# Altium project Antenna_base.PrjPcb
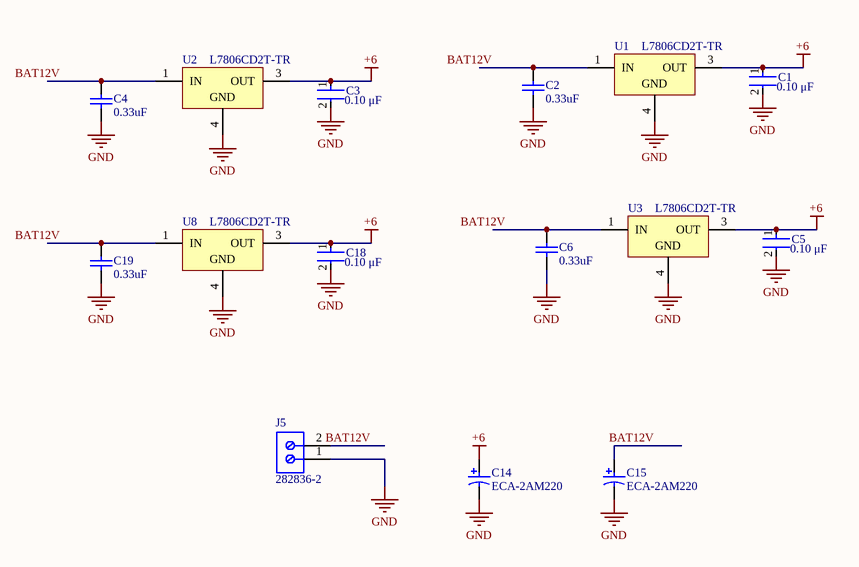
[diagram p0: 01_powersupply.SchDoc]
8 sheets, 143 parts. Net scope: global (net labels, ports and power ports of the same name join across sheets).
Board file: Antenna_base_v5.PcbDoc
Sheets:
  01_powersupply.SchDoc
  02_USB2UART.SchDoc
  05_PWMdriver.SchDoc
  08_CoreBoard.SchDoc
  10_IMU_BREAKOUT.SchDoc
  11_GPS_BREAKOUT.SchDoc
  12_OLED_SCREEN.SchDoc
  13_LED_Array.SchDoc

## Sheet 01_powersupply.SchDoc
size A

### Parts
C1  Capacitance: 0.10 μF  [FP-C0603C-CF-MFG]  (hidden comment: C0603_0.1UF)
C2  value 0.33uF  [CAPC1608X90X20LL10]  (hidden comment: C0603_0.33UF)
C3  Capacitance: 0.10 μF  [FP-C0603C-CF-MFG]  (hidden comment: C0603_0.1UF)
C4  value 0.33uF  [CAPC1608X90X20LL10]  (hidden comment: C0603_0.33UF)
C5  Capacitance: 0.10 μF  [FP-C0603C-CF-MFG]  (hidden comment: C0603_0.1UF)
C6  value 0.33uF  [CAPC1608X90X20LL10]  (hidden comment: C0603_0.33UF)
C14  ECA-2AM220  [CAPPR55-250-1120X630X1220]
C15  ECA-2AM220  [CAPPR55-250-1120X630X1220]
C18  Capacitance: 0.10 μF  [FP-C0603C-CF-MFG]  (hidden comment: C0603_0.1UF)
C19  value 0.33uF  [CAPC1608X90X20LL10]  (hidden comment: C0603_0.33UF)
J5  282836-2  [TECO-282836-2_V]
U1  L7806CD2T-TR  [TO-263_L]
U2  L7806CD2T-TR  [TO-263_L]
U3  L7806CD2T-TR  [TO-263_L]
U8  L7806CD2T-TR  [TO-263_L]

### Nets
+6: C1.1 C3.1 C5.1 C14.1 C18.1 U1.3(OUT) U2.3(OUT) U3.3(OUT) U8.3(OUT)  [project net PWM_VDD]
GND: C1.2 C2.1 C3.2 C4.1 C5.2 C6.1 C14.2 C15.2 C18.2 C19.1 J5.1 U1.4(GND) U2.4(GND) U3.4(GND) U8.4(GND)
BAT12V: C2.2 C4.2 C6.2 C15.1 C19.2 J5.2 U1.1(IN) U2.1(IN) U3.1(IN) U8.1(IN)

### Library data of the parts
C1 C3 C5 C18 = CMP-03020-016578-1: CAP CER 0.1UF 16V X7R 0603; Manufacturer Part Number: C0603C104M4RAC7411; Manufacturer: KEMET; Tolerance: 0.2; Value: 0.10 μF; Automotive Grade: Grade 1; Material: Ceramic; Temperature Coefficient: 30ppm/°C; RoHS: TRUE; Temperature: -55°C to +125°C; Automotive: Yes; Device Class L3: Ceramic Capacitors; Temperature Characteristic: X7R; Package: C0603C-CF; Digikey Description: CAP CER 0.1UF 16V X7R 0603; ComponentLink2URL: https://api.kemet.com/component-edge/download/datasheet/C0603C100J5GACAUTO.pdf; Mouser Description: Multilayer Ceramic Capacitors MLCC - SMD/SMT 16volts 0.1uF X7R 20%; Voltage Rating: 16 V; Temperature Range High: +125°C; Temperature Range Low: -55°C; Height: 0.87mm; Device Class L1: Passive Components; ComponentLink2Description: Datasheet; Lead Free: Yes; Category: Cap; Device Class L2: Capacitors; Octopart: https://octopart.com/c0603c104m4rac7411-kemet-9138805
C2 C4 C6 C19 = CMP-2000-07551-1: Chip Capacitor, 0.33 uF, +/- 10%, 50 V, -55 to 125 degC, 0603 (1608 Metric), RoHS, Tape and Reel; Manufacturer: TDK; Datasheet URL: https://product.tdk.com/info/en/catalog/datasheets/mlcc_commercial_general_en.pdf; Manufacturer URL: http://www.tdk.com/; Package Description: 2-Pin Surface Mount Device, Body 1.6 x 0.8 mm; Mounting Technology: SurfaceMount; Datasheet Version: 07/2017; Package Reference: 603
C14 C15 = CMP-1665-00035-2: Aluminum Electrolytic Capacitor, 22 uF, +/- 20%, 100 V, -40 to 85 degC, 2-Pin THD, RoHS, Bulk; Nominal Vf: 2.1 V; Luminous Intensity: 2 mcd; Viewing Angle: 130 degrees; Lens Style: Clear; Colour: Orange; Forward Current: 20 mA; Case\Package: 0603; ComponentLink2URL: https://industrial.panasonic.com/cdbs/www-data/pdf/RDF0000/ABA0000C1047.pdf; Height: 1.1 mm; Max Operating Temperature: 85 degC; Width: 0.8 mm; ComponentLink1Description: Manufacturer URL; Min Operating Temperature: -55 degC; Package Quantity: 3000; RoHSCompliant: true; DatasheetVersion: Mar-16; Length: 1.6 mm; ComponentLink1URL: http://www.panasonic.com/; Packaging: Tape and Reel; Case Code (Imperial): 0603; Radiation Hardening: No; ComponentLink2Description: Datasheet; Mount: Surface Mount; PackageDescription: 2-Pin Through Hole Device, Dia 6.3 mm, Body Length 11.2 mm; Pins: 2; PackageReference: Radial; Illumination Colour: Orange; Case Code (Metric): 1608; Forward Voltage: 2.1 V
J5 = CMP-1684-00017-1: Female Header, Pitch 5 mm, 1 x 2 Position, Height 10 mm, Tail Length 3.5 mm, Rohs, Bulk; Manufacturer: TE Connectivity; Wire Gauge: 16-30AWG; Product Training Modules: Wire-to-BoardEurostyleTerminalBlocks; Clamp Material - Plating: Brass-NickelPlated; Voltage: 300V; Mating Orientation: HorizontalwithBoard; Current: 13.5A; Pitch: 0.197"(5.00mm); Screw Thread: M3; 3D Model: 282836-2.pdf; Other Names: 5ULV-02B / A98076; Dynamic Catalog: BuchananSeries; Number of Levels: 1; Torque - Screw: 0.68Nm(6Lb-In); Featured Product: EurostyleTerminalBlockConnectors; Positions Per Level: 2; Wire Termination: Screw-RisingCageClamp; Datasheet URL: http://www.te.com.cn/commerce/DocumentDelivery/DDEController?Action=showdoc&DocId=Catalog+Section%7F1308389_EUROSTYLE_TERMINAL_BLOCKS%7F0607%7Fpdf%7FEnglish%7FENG_CS_1308389_EUROSTYLE_TERMINAL_BLOCKS_0607.pdf%7F282836-2; Color: Green; Family: TerminalBlocks-WiretoBoard; RoHS Information: 282836-2StatementofCompliance; Standard Package: 300; Contact Material - Plating: Brass-TinPlated; Manufacturer URL: http://www.te.com; Housing Material: Polyamide(PA66),Nylon6/6; Features: Interlocking(Side); Package Description: Female Header, Pitch 5 mm, 1 x 2 Position, Height 10 mm, Tail Length 3.5 mm; Mounting Type: ThroughHole; Package Reference: THD; Packaging: Bulk; Series: Buchanan; Category: Connectors,Interconnects; Screw Material - Plating: Brass-NickelPlated
U1-U3 U8 = CMP-0244-00208-1: Positive Voltage Regulator, 3-Pin D2PAK, Tape and Reel; PackageDescription: 3-Pin Transistor Outline Package 2.54 mm Pitch, 15.4 mm Lead Span (D2PAK); ComponentLink1Description: Manufacturer URL; ComponentLink2URL: http://www.st.com/internet/com/TECHNICAL_RESOURCES/TECHNICAL_LITERATURE/DATASHEET/CD00000444.pdf; ComponentLink1URL: http://www.st.com; ComponentLink2Description: Datasheet; DatasheetVersion: 16/11/2011; PackageReference: TO-263; PackageVersion: 2011

## Sheet 02_USB2UART.SchDoc
size Letter
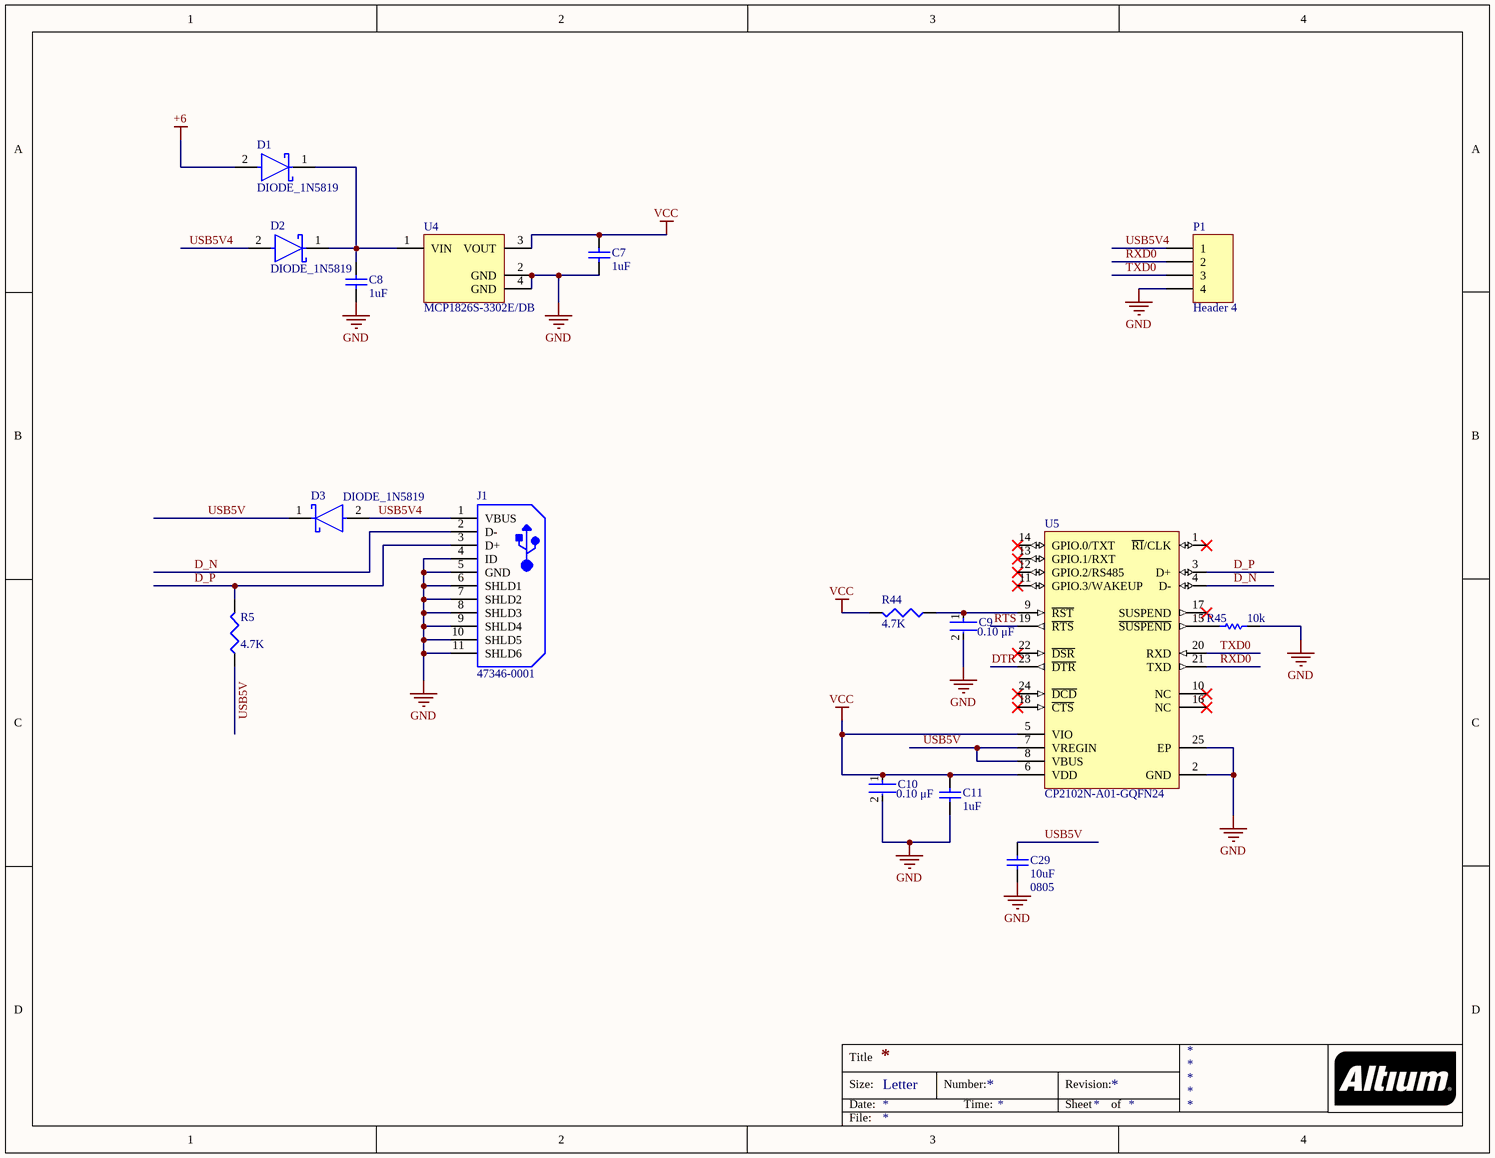
[diagram p1: 02_USB2UART.SchDoc]

### Parts
C7  value 1uF  [CAPC1608X87X35LL15T15]  (hidden comment: C0603_1UF)
C8  value 1uF  [CAPC1608X87X35LL15T15]  (hidden comment: C0603_1UF)
C9  Capacitance: 0.10 μF  [FP-C0603C-CF-MFG]  (hidden comment: C0603_0.1UF)
C10  Capacitance: 0.10 μF  [FP-C0603C-CF-MFG]  (hidden comment: C0603_0.1UF)
C11  value 1uF  [CAPC1608X87X35LL15T15]  (hidden comment: C0603_1UF)
C29  value 10uF  Package: 0805  [CAPC2013X135X50LL10T20]  (hidden comment: C0805_10UF)
D1  DIODE_1N5819  [FP-SOD123-MFG]
D2  DIODE_1N5819  [FP-SOD123-MFG]
D3  DIODE_1N5819  [FP-SOD123-MFG]
J1  47346-0001  [MOLX-47346-0001-5_V]
P1  Header 4  [HDR1X4]
R5  value 4.7K  [J1-0603]  (hidden comment: R0603_4.7K)
R44  value 4.7K  [J1-0603]  (hidden comment: R0603_4.7K)
R45  value 10k  [RESC1609X55X30LL15T15]  (hidden comment: R0603_10K)
U4  MCP1826S-3302E/DB  [SOT-223-DB3_L]
U5  CP2102N-A01-GQFN24  [SLAB-QFN-24-2550x2550TP_A_V]

### Nets
+6: D1.2(A)  [project net PWM_VDD]
GND: C7.1 C8.1 C9.2 C10.2 C11.1 C29.1 J1.4(ID) J1.5(GND) J1.6(SHLD1) J1.7(SHLD2) J1.8(SHLD3) J1.9(SHLD4) J1.10(SHLD5) J1.11(SHLD6) P1.4 R45.2 U4.2(GND) U4.4(GND) U5.2(GND) U5.25(EP)
VCC: C7.2 C10.1 C11.2 R44.2 U4.3(VOUT) U5.5(VIO) U5.6(VDD)
D_N: J1.2(D-) U5.4(D-)
D_P: J1.3(D+) R5.2 U5.3(D+)
DTR: U5.23(~{DTR})
RTS: U5.19(~{RTS})
RXD0: P1.2 U5.21(TXD)
TXD0: P1.3 U5.20(RXD)
USB5V: C29.2 D3.1(C) R5.1 U5.7(VREGIN) U5.8(VBUS)
USB5V4: D2.2(A) D3.2(A) J1.1(VBUS) P1.1
NetC8_2: C8.2 D1.1(C) D2.1(C) U4.1(VIN)
NetC9_1: C9.1 R44.1 U5.9(~{RST})
NetR45_1: R45.1 U5.15(~{SUSPEND})

Not connected (* = marked no-connect by the designer): U5 1(~{RI}/CLK)* 10(NC)* 11(GPIO.3/WAKEUP)* 12(GPIO.2/RS485)* 13(GPIO.1/RXT)* 14(GPIO.0/TXT)* 16(NC)* 17(SUSPEND)* 18(~{CTS})* 22(~{DSR})* 24(~{DCD})*

### Notes on the sheet
- Title
- Size:
- Date:
- Letter
- Number:
- Time:
- Revision:
- Sheet
- of
- File:

### Library data of the parts
C7 C8 C11 = CMP-2006-03318-1: Manufacturer: Kemet; Part Number: C0603C101J1GACTU
C9 C10 = CMP-03020-016578-1: as C1 on sheet 01_powersupply; RoHS: TRUE; Temperature: -55°C to +125°C; Automotive: Yes; Device Class L3: Ceramic Capacitors; Temperature Characteristic: X7R; Package: C0603C-CF; Digikey Description: CAP CER 0.1UF 16V X7R 0603; ComponentLink2URL: https://api.kemet.com/component-edge/download/datasheet/C0603C100J5GACAUTO.pdf; Mouser Description: Multilayer Ceramic Capacitors MLCC - SMD/SMT 16volts 0.1uF X7R 20%; Voltage Rating: 16 V; Temperature Range High: +125°C; Temperature Range Low: -55°C; Height: 0.87mm; Device Class L1: Passive Components; ComponentLink2Description: Datasheet; Lead Free: Yes; Category: Cap; Device Class L2: Capacitors; Octopart: https://octopart.com/c0603c104m4rac7411-kemet-9138805
C29 = CMP-2007-03453-1: Manufacturer: Murata; Part Number: GRM21BR61C106KE15L
D1-D3 = CMP-12790-000018-1: DIODE SCHOTTKY 40V 1A SOD123; Manufacturer: Diodes Inc; Manufacturer Part Number: 1N5819HW-7-F; Max Surge Forward Current: 25A; Peak Reverse Current: 1mA; Max Junction Temp: +125°C; Import Ts: 1521843113; Vr V: 40; Standoff Height: 0mm; Capacitance: 50pF; Value: 50pF; Ciiva Ids: 815630; If A: 1; Automotive: No; Device Class L1: Discrete Semiconductors; Octopart: https://octopart.com/1n5819hw-7-f-diodes+inc.-323197; Terminal Temperature Tt Degc: 90; ComponentLink2Description: Datasheet; Temperature Range High: +125°C; Package: SOD123; Reverse Voltage: 40V; Temperature Range Low: -65°C; Mouser Description: 1N5819HW Series 40 V 1 A Surface Mount Schottky Barrier Rectifier - SOD-123; Device Class L2: Diodes; Lead Free: Yes; Max Repetitive Reverse Voltage: 40V; Ipc Land Pattern Name: SOD365155X123-2; Forward Current: 1A; Device Class L3: Schottky Diodes; Digikey Description: DIODE SCHOTTKY 40V 1A SOD123; ComponentLink2URL: https://www.diodes.com/assets/Datasheets/ds30217.pdf; Footprint Url: https://www.diodes.com/assets/Package-Files/SOD123.pdf; RoHS: TRUE; Category: Diode; Height: 1.45mm; Release Date: 1385348939; Temperature: -65°C to +125°C
J1 = CMP-2000-05246-1: Micro-USB B Receptacle with Flange, -30 to 85 degC, 5-Pin SMD, RoHS, Tape and Reel; Manufacturer: Molex; Number of Contacts: 5; Body Orientation: RightAngle; Maximum Voltage Rating: 30VAC; Pitch: 0.65mm; Maximum Current Rating: 1.8/ContactA; Number of Ports: 1; Gender: RCP; Operating Temperature: -30to85C; Part No: 47346-0001; Color: Black; Termination Method: Solder; Contact Plating: GoldOverPalladiumNickelOverNickel; Dimension: 7.8x5.43x2.94mm; Number of Terminals: 5; Datasheet Version: Dec-13; Datasheet URL: https://datasheet.ciiva.com/30075/304740473460001-io-nectors-30075527.pdf; Contact Material: CopperAlloy; RoHS: Yes; Housing Material: LiquidCrystalPolymer; Manufacturer URL: http://www.molex.com/; Packaging: EmbossedTapeandReel; Mounting: SurfaceMount; Type: MicroUSBTypeB
P1 = Header 4: Header, 4-Pin; LatestRevisionDate: 17-Jul-2002; LatestRevisionNote: Re-released for DXP Platform.; Publisher: Altium Limited
R5 R44 = Res3: Resistor; Published: 8-Jun-2000; LatestRevisionDate: 29-May-2009; LatestRevisionNote: IPC-7351 Footprint Added.; PackageReference: J1-0603; Publisher: Altium Limited; PackageDescription: Chip Resistor
R45 = CMP-2000-07452-1: Chip Resistor, 10 KOhm, +/- 1%, 0.1 W, -55 to 155 degC, 0603 (1608 Metric), RoHS, Tape and Reel; Manufacturer: Panasonic; Voltage Rating: 75V; Case\/Package: 0603; Power Rating: 100mW; Resistance: 10KOhm; Temperature Coefficient: 100ppm\/degreesC; Number of Pins: 2; Package Reference: 603; Depth: 0.8mm; Mount: SurfaceMount; Package Description: 2-Pin Surface Mount Device, Body 1.6 x 0.85 mm; Datasheet Version: 02/2017; Length: 1.6mm; Lead Free: LeadFree; Height: 0.45mm; Number of Terminations: 2; Max Power Dissipation: 100mW; Min Operating Temperature: -55degC; Datasheet URL: https://industrial.panasonic.com/cdbs/www-data/pdf/RDA0000/AOA0000C304.pdf; Termination: SMD/SMT; Case Code (Metric): 1608; Case Code (Imperial): 0603; Tolerance: 1%; Max Operating Temperature: 155degC; RoHSCompliant: true; Voltage Rating (DC): 75V; Radiation Hardening: No; Packaging: TapeandReel; Composition: ThickFilm; Mounting Technology: SurfaceMount; Manufacturer URL: http://www.panasonic.com/; Width: 0.031inch; REACH SVHC: NoSVHC; Contact Plating: Tin; Military Standard: Not; Package Quantity: 1
U4 = CMP-0136-00504-1: 1000 mA, Low Voltage, Low Quiescent Current LDO Regulator, 3-Pin SOT-223, Extended Temperature; PackageVersion: revBB, Aug-2009; PackageReference: SOT-223-DB3; DatasheetVersion: revA, Aug-2007; PackageDescription: 3-Lead Plastic Small Outline Transistor (DB) [SOT-223]
U5 = CMP-2000-07570-1: USBXpress(TM) Family, 4 GPIOs, 2.2 to 3.6 V, -40 to 85 degC, 24-Pin QFN, RoHS; Manufacturer: Silicon Labs; Max Supply Voltage: 3.6V; Min Supply Voltage: 3V; Datasheet Version: Rev. 1.1, 08/2016; Max Operating Temperature: 85degC; Case\/Package: QFN; Number of Pins: 24; Min Operating Temperature: -40degC; Mounting Technology: SurfaceMount; Manufacturer URL: http://www.silabs.com/; RoHSCompliant: False; Package Reference: QFN-24-2550x2550TP_A; Datasheet URL: http://www.silabs.com/documents/public/data-sheets/cp2102n-datasheet.pdf; Package Description: 24-Pin Quad Flat No-lead Package, Body 4 x 4 mm, Pitch 0.5 mm; REACH SVHC: Unknown

## Sheet 05_PWMdriver.SchDoc
size A
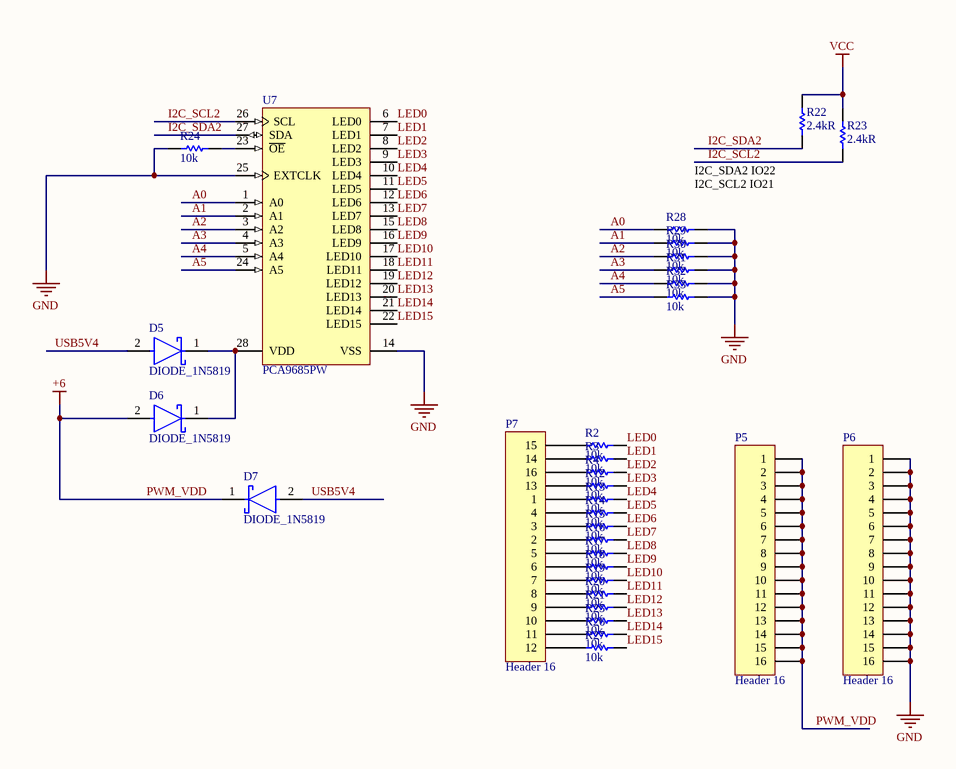
[diagram p2: 05_PWMdriver.SchDoc]

### Parts
D5  DIODE_1N5819  [FP-SOD123-MFG]
D6  DIODE_1N5819  [FP-SOD123-MFG]
D7  DIODE_1N5819  [FP-SOD123-MFG]
P5  Header 16  [HDR1X16]
P6  Header 16  [HDR1X16]
P7  Header 16  [HDR1X16]
R2  value 10k  [RESC1609X55X30LL15T15]  (hidden comment: R0603_10K)
R3  value 10k  [RESC1609X55X30LL15T15]  (hidden comment: R0603_10K)
R4  value 10k  [RESC1609X55X30LL15T15]  (hidden comment: R0603_10K)
R12  value 10k  [RESC1609X55X30LL15T15]  (hidden comment: R0603_10K)
R13  value 10k  [RESC1609X55X30LL15T15]  (hidden comment: R0603_10K)
R14  value 10k  [RESC1609X55X30LL15T15]  (hidden comment: R0603_10K)
R15  value 10k  [RESC1609X55X30LL15T15]  (hidden comment: R0603_10K)
R16  value 10k  [RESC1609X55X30LL15T15]  (hidden comment: R0603_10K)
R17  value 10k  [RESC1609X55X30LL15T15]  (hidden comment: R0603_10K)
R18  value 10k  [RESC1609X55X30LL15T15]  (hidden comment: R0603_10K)
R19  value 10k  [RESC1609X55X30LL15T15]  (hidden comment: R0603_10K)
R20  value 10k  [RESC1609X55X30LL15T15]  (hidden comment: R0603_10K)
R21  value 10k  [RESC1609X55X30LL15T15]  (hidden comment: R0603_10K)
R22  value 2.4kR  [RESC1608X50X30ML20T20]  (hidden comment: R0603_2.4K)
R23  value 2.4kR  [RESC1608X50X30ML20T20]  (hidden comment: R0603_2.4K)
R24  value 10k  [RESC1609X55X30LL15T15]  (hidden comment: R0603_10K)
R25  value 10k  [RESC1609X55X30LL15T15]  (hidden comment: R0603_10K)
R26  value 10k  [RESC1609X55X30LL15T15]  (hidden comment: R0603_10K)
R27  value 10k  [RESC1609X55X30LL15T15]  (hidden comment: R0603_10K)
R28  value 10k  [RESC1609X55X30LL15T15]  (hidden comment: R0603_10K)
R29  value 10k  [RESC1609X55X30LL15T15]  (hidden comment: R0603_10K)
R30  value 10k  [RESC1609X55X30LL15T15]  (hidden comment: R0603_10K)
R31  value 10k  [RESC1609X55X30LL15T15]  (hidden comment: R0603_10K)
R32  value 10k  [RESC1609X55X30LL15T15]  (hidden comment: R0603_10K)
R33  value 10k  [RESC1609X55X30LL15T15]  (hidden comment: R0603_10K)
U7  PCA9685PW  [SOT361-1_V]

### Nets
GND: P6.1 P6.2 P6.3 P6.4 P6.5 P6.6 P6.7 P6.8 P6.9 P6.10 P6.11 P6.12 P6.13 P6.14 P6.15 P6.16 R24.2 R28.1 R29.1 R30.1 R31.1 R32.1 R33.1 U7.14(VSS) U7.25(EXTCLK)
PWM_VDD: D6.2(A) D7.1(C) P5.1 P5.2 P5.3 P5.4 P5.5 P5.6 P5.7 P5.8 P5.9 P5.10 P5.11 P5.12 P5.13 P5.14 P5.15 P5.16  [also labelled +6]
VCC: R22.2 R23.2
A0: R28.2 U7.1(A0)
A1: R29.2 U7.2(A1)
A2: R30.2 U7.3(A2)
A3: R31.2 U7.4(A3)
A4: R32.2 U7.5(A4)
A5: R33.2 U7.24(A5)
I2C_SCL2: R23.1 U7.26(SCL)
I2C_SDA2: R22.1 U7.27(SDA)
LED0: R2.1 U7.6(LED0)
LED1: R3.1 U7.7(LED1)
LED2: R4.1 U7.8(LED2)
LED3: R12.1 U7.9(LED3)
LED4: R13.1 U7.10(LED4)
LED5: R14.1 U7.11(LED5)
LED6: R15.1 U7.12(LED6)
LED7: R16.1 U7.13(LED7)
LED8: R17.1 U7.15(LED8)
LED9: R18.1 U7.16(LED9)
LED10: R19.1 U7.17(LED10)
LED11: R20.1 U7.18(LED11)
LED12: R21.1 U7.19(LED12)
LED13: R25.1 U7.20(LED13)
LED14: R26.1 U7.21(LED14)
LED15: R27.1 U7.22(LED15)
USB5V4: D5.2(A) D7.2(A)
NetD5_1: D5.1(C) D6.1(C) U7.28(VDD)
NetP7_1: P7.1 R13.2
NetP7_2: P7.2 R16.2
NetP7_3: P7.3 R15.2
NetP7_4: P7.4 R14.2
NetP7_5: P7.5 R17.2
NetP7_6: P7.6 R18.2
NetP7_7: P7.7 R19.2
NetP7_8: P7.8 R20.2
NetP7_9: P7.9 R21.2
NetP7_10: P7.10 R25.2
NetP7_11: P7.11 R26.2
NetP7_12: P7.12 R27.2
NetP7_13: P7.13 R12.2
NetP7_14: P7.14 R3.2
NetP7_15: P7.15 R2.2
NetP7_16: P7.16 R4.2
NetR24_1: R24.1 U7.23(~{OE})

### Notes on the sheet
- I2C_SDA2 IO22
  I2C_SCL2 IO21

### Library data of the parts
D5-D7 = CMP-12790-000018-1: as D1 on sheet 02_USB2UART; Automotive: No; Device Class L1: Discrete Semiconductors; Octopart: https://octopart.com/1n5819hw-7-f-diodes+inc.-323197; Terminal Temperature Tt Degc: 90; ComponentLink2Description: Datasheet; Temperature Range High: +125°C; Package: SOD123; Reverse Voltage: 40V; Temperature Range Low: -65°C; Mouser Description: 1N5819HW Series 40 V 1 A Surface Mount Schottky Barrier Rectifier - SOD-123; Device Class L2: Diodes; Lead Free: Yes; Max Repetitive Reverse Voltage: 40V; Ipc Land Pattern Name: SOD365155X123-2; Forward Current: 1A; Device Class L3: Schottky Diodes; Digikey Description: DIODE SCHOTTKY 40V 1A SOD123; ComponentLink2URL: https://www.diodes.com/assets/Datasheets/ds30217.pdf; Footprint Url: https://www.diodes.com/assets/Package-Files/SOD123.pdf; RoHS: TRUE; Category: Diode; Height: 1.45mm; Release Date: 1385348939; Temperature: -65°C to +125°C
P5-P7 = Header 16: Header, 16-Pin; LatestRevisionDate: 17-Jul-2002; LatestRevisionNote: Re-released for DXP Platform.; Publisher: Altium Limited
R2-R4 R12-R21 R24-R33 = CMP-2000-07452-1: as R45 on sheet 02_USB2UART; Number of Pins: 2; Package Reference: 603; Depth: 0.8mm; Mount: SurfaceMount; Package Description: 2-Pin Surface Mount Device, Body 1.6 x 0.85 mm; Datasheet Version: 02/2017; Length: 1.6mm; Lead Free: LeadFree; Height: 0.45mm; Number of Terminations: 2; Max Power Dissipation: 100mW; Min Operating Temperature: -55degC; Datasheet URL: https://industrial.panasonic.com/cdbs/www-data/pdf/RDA0000/AOA0000C304.pdf; Termination: SMD/SMT; Case Code (Metric): 1608; Case Code (Imperial): 0603; Tolerance: 1%; Max Operating Temperature: 155degC; RoHSCompliant: true; Voltage Rating (DC): 75V; Radiation Hardening: No; Packaging: TapeandReel; Composition: ThickFilm; Mounting Technology: SurfaceMount; Manufacturer URL: http://www.panasonic.com/; Width: 0.031inch; REACH SVHC: NoSVHC; Contact Plating: Tin; Military Standard: Not; Package Quantity: 1
R22 R23 = CMP-2000-02561-1: Part Number: RR0816P-242-D; Manufacturer: Susumu
U7 = CMP-1595-00004-2: 16-Channel, 12-Bit PWM Fm+ I2C-Bus LED Controller, 2.3 to 5.5 V, -40 to 85 degC, 28-Pin TSSOP (SOT361-1), RoHS, Tape and Reel; Supply Current Max: 10 mA; Supply Voltage Min: 2.3 V; Supply Voltage Max: 5.5 V; Frequency: 25000000 Hz; Temperature Min: -40 degC; PackageDescription: 28-Pin Small Outline Package, Body 9.7 x 4.4 mm, Pitch 0.65 mm; RoHS: TRUE; ComponentLink1Description: Manufacturer URL; Code_JEDEC: MO-153; PartNumber: PCA9685; ComponentLink2URL: http://www.nxp.com/documents/data_sheet/PCA9685.pdf; Packing: Tape and Reel; ComponentLink1URL: http://www.nxp.com/; ComponentLink3Description: Package Specification; ComponentLink2Description: Datasheet; ComponentLink3URL: http://www.nxp.com/documents/outline_drawing/sot361-1_po.pdf; DatasheetVersion: Rev. 4; Temperature Max: 85 degC; PackageVersion: 02/2003; Mounting Technology: Surface Mount

## Sheet 08_CoreBoard.SchDoc
size A3
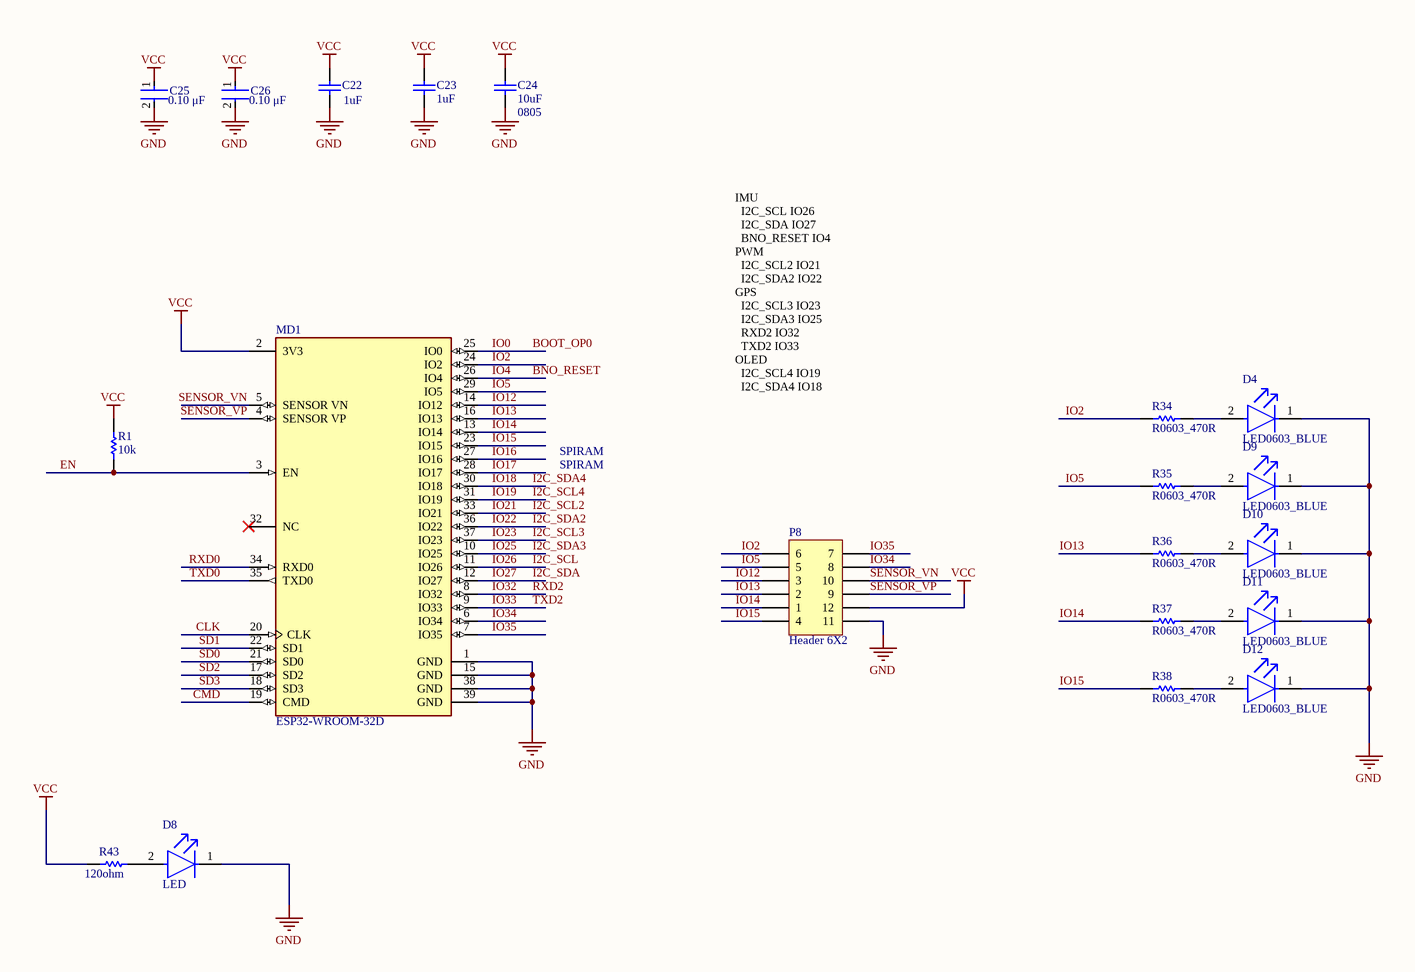
[diagram p3: 08_CoreBoard.SchDoc]

### Parts
C22  value 1uF  [CAPC1608X87X35LL15T15]  (hidden comment: C0603_1UF)
C23  value 1uF  [CAPC1608X87X35LL15T15]  (hidden comment: C0603_1UF)
C24  value 10uF  Package: 0805  [CAPC2013X135X50LL10T20]  (hidden comment: C0805_10UF)
C25  Capacitance: 0.10 μF  [FP-C0603C-CF-MFG]  (hidden comment: C0603_0.1UF)
C26  Capacitance: 0.10 μF  [FP-C0603C-CF-MFG]  (hidden comment: C0603_0.1UF)
D4  LED0603_BLUE  [FP-LTST-C191TBKT-MFG]
D8  LED  [FP-LTST-C190GKT-MFG]
D9  LED0603_BLUE  [FP-LTST-C191TBKT-MFG]
D10  LED0603_BLUE  [FP-LTST-C191TBKT-MFG]
D11  LED0603_BLUE  [FP-LTST-C191TBKT-MFG]
D12  LED0603_BLUE  [FP-LTST-C191TBKT-MFG]
MD1  ESP32-WROOM-32D  [FP-ESP32-WROOM-32D-MFG]
P8  Header 6X2  [HDR2X6]
R1  value 10k  [RESC1609X55X30LL15T15]  (hidden comment: R0603_10K)
R34  R0603_470R  [RESC1608X55X30NL15T15]
R35  R0603_470R  [RESC1608X55X30NL15T15]
R36  R0603_470R  [RESC1608X55X30NL15T15]
R37  R0603_470R  [RESC1608X55X30NL15T15]
R38  R0603_470R  [RESC1608X55X30NL15T15]
R43  value 120ohm  [RESC1608X55X30NL20T20]  (hidden comment: R0603_120R)

### Nets
GND: C22.1 C23.1 C24.1 C25.2 C26.2 D4.1(C) D8.1(C) D9.1(C) D10.1(C) D11.1(C) D12.1(C) MD1.1(GND) MD1.15(GND) MD1.38(GND) MD1.39(GND) P8.11
VCC: C22.2 C23.2 C24.2 C25.1 C26.1 MD1.2(3V3) P8.12 R1.1 R43.1
BNO_RESET: MD1.26(IO4)  [also labelled IO4]
BOOT_OP0: MD1.25(IO0)  [also labelled IO0]
CLK: MD1.20(CLK)
CMD: MD1.19(CMD)
EN: MD1.3(EN) R1.2
I2C_SCL: MD1.11(IO26)  [also labelled IO26]
I2C_SCL2: MD1.33(IO21)  [also labelled IO21]
I2C_SCL3: MD1.37(IO23)  [also labelled IO23]
I2C_SCL4: MD1.31(IO19)  [also labelled IO19]
I2C_SDA: MD1.12(IO27)  [also labelled IO27]
I2C_SDA2: MD1.36(IO22)  [also labelled IO22]
I2C_SDA3: MD1.10(IO25)  [also labelled IO25]
I2C_SDA4: MD1.30(IO18)  [also labelled IO18]
IO2: MD1.24(IO2) P8.6 R34.1
IO5: MD1.29(IO5) P8.5 R35.1
IO12: MD1.14(IO12) P8.3
IO13: MD1.16(IO13) P8.2 R36.1
IO14: MD1.13(IO14) P8.1 R37.1
IO15: MD1.23(IO15) P8.4 R38.1
IO16: MD1.27(IO16)
IO17: MD1.28(IO17)
IO32: MD1.8(IO32)  [also labelled RXD2]
IO33: MD1.9(IO33)  [also labelled TXD2]
IO34: MD1.6(IO34) P8.8
IO35: MD1.7(IO35) P8.7
RXD0: MD1.34(RXD0)
SD0: MD1.21(SD0)
SD1: MD1.22(SD1)
SD2: MD1.17(SD2)
SD3: MD1.18(SD3)
SENSOR_VN: MD1.5(SENSOR_VN) P8.10
SENSOR_VP: MD1.4(SENSOR_VP) P8.9
TXD0: MD1.35(TXD0)
NetD4_2: D4.2(A) R34.2
NetD8_2: D8.2(A) R43.2
NetD9_2: D9.2(A) R35.2
NetD10_2: D10.2(A) R36.2
NetD11_2: D11.2(A) R37.2
NetD12_2: D12.2(A) R38.2

Not connected (* = marked no-connect by the designer): MD1 32(NC)*

### Notes on the sheet
- IMU
  I2C_SCL IO26
  I2C_SDA IO27
  BNO_RESET IO4
  PWM
  I2C_SCL2 IO21
  I2C_SDA2 IO22
  GPS
  I2C_SCL3 IO23
  I2C_SDA3 IO25
  RXD2 IO32
  TXD2 IO33
  OLED
  I2C_SCL4 IO19
  I2C_SDA4 IO18
- SPIRAM
- Title
- Size:
- Date:
- A3
- Number:
- Time:
- Revision:
- Sheet
- of
- File:

### Library data of the parts
C22 C23 = CMP-2006-03318-1: as C7 on sheet 02_USB2UART
C24 = CMP-2007-03453-1: as C29 on sheet 02_USB2UART
C25 C26 = CMP-03020-016578-1: as C1 on sheet 01_powersupply; RoHS: TRUE; Temperature: -55°C to +125°C; Automotive: Yes; Device Class L3: Ceramic Capacitors; Temperature Characteristic: X7R; Package: C0603C-CF; Digikey Description: CAP CER 0.1UF 16V X7R 0603; ComponentLink2URL: https://api.kemet.com/component-edge/download/datasheet/C0603C100J5GACAUTO.pdf; Mouser Description: Multilayer Ceramic Capacitors MLCC - SMD/SMT 16volts 0.1uF X7R 20%; Voltage Rating: 16 V; Temperature Range High: +125°C; Temperature Range Low: -55°C; Height: 0.87mm; Device Class L1: Passive Components; ComponentLink2Description: Datasheet; Lead Free: Yes; Category: Cap; Device Class L2: Capacitors; Octopart: https://octopart.com/c0603c104m4rac7411-kemet-9138805
D4 D9-D12 = CMP-22017-000008-1: LED BLUE CLEAR CHIP SMD; Lens Color: Colorless; Dominant Wavelength: 475nm; Forward Current: 20mA; Wavelength: 468nm; Viewing Angle: 130°; Power Dissipation: 76mW; Luminous Intensity: 180mcd; Reverse Voltage: 5V; Number of Elements: 1; Lens Style: Diffused; Forward Voltage: 3.8V; Max Power Dissipation: 75mW; Case Code (Metric): 1608; Packaging: Tape and Reel; Case/Package: 0603; Depth: 1.6mm; Mount: Surface Mount; Lead Free: Lead Free; Min Operating Temperature: -20°C; Lens Transparency: Clear; Illumination Color: Blue; Height: 0.55mm; Test Current: 20mA; Case Code (Imperial): 0603; Max Operating Temperature: 80°C; Number of Pins: 2; Length: 0.8mm; Radiation Hardening: No; Package Quantity: 1; Number of LEDs: 1; Width: 0.8mm; Color: Blue
D8 = CMP-22017-000005-1: LED GREEN CLEAR CHIP SMD; Reverse Voltage: 5V; Power Dissipation: 100mW; Forward Voltage: 2.1V; Test Current: 10mA; Number of LEDs: 1; Viewing Angle: 130°; Forward Current: 30mA; Voltage: 2V; Wavelength: 565nm; Dominant Wavelength: 569nm; Luminous Intensity: 6mcd; Lens Color: Colorless; Packaging: Tape and Reel; Lens Transparency: Clear; Min Operating Temperature: -55°C; Case Code (Metric): 1608; Lens Style: Clear; Case/Package: 0603; Mount: Surface Mount; Package Quantity: 1; Height: 0.8mm; Illumination Color: Green; Radiation Hardening: No; Depth: 0.8mm; Number of Pins: 2; Max Operating Temperature: 85°C; Color: Green; Number of Elements: 1; Power Rating: 100mW; Case Code (Imperial): 0603; Width: 0.8mm; Length: 1.6mm; Lead Free: Lead Free
MD1 = CMP-194065-000003-1: WIFI MODULE 32MBITS SPI FLASH; Manufacturer: Espressif Systems; Max Supply Voltage: 3.6V; Nominal Supply Current: 500mA; Max Frequency: 2484MHz; Number Of Adc Channels: 16; Number Of Gpio: 32; Interface: I2C,SPI,UART,Ethernet,I2S,Other; Data Rate: 150Mbits/s; Min Supply Voltage: 3V; Bandwidth: 72MHz; Sensitivity: -98dBm; Octopart: https://octopart.com/esp32-wroom-32d-espressif+systems-91040050; Package: ESP32-WROOM-32D; ComponentLink2URL: https://www.espressif.com/sites/default/files/documentation/esp32-wroom-32d_esp32-wroom-32u_datasheet_en.pdf; Lead Free: Yes; Category: UNK; Mouser Description: Wi-Fi/BT BLE Module ESP32-D0WD, SPI Flash, UART, P; Device Class L1: Integrated Circuits (ICs); RoHS: TRUE; Temperature Range Low: -40°C; ComponentLink2Description: Datasheet; Digikey Description: WIFI MODULE 32MBITS SPI FLASH; Height: 3.2mm; Temperature: -40°C to +85°C; Manufacturer Part Number: ESP32-WROOM-32D; Device Class L3: Transceivers; Device Class L2: RF Semiconductors and Devices; Temperature Range High: +85°C; Automotive: No
P8 = Header 6X2: Header, 6-Pin, Dual row; LatestRevisionDate: 17-Jul-2002; LatestRevisionNote: Re-released for DXP Platform.; Publisher: Altium Limited
R1 = CMP-2000-07452-1: as R45 on sheet 02_USB2UART; Number of Pins: 2; Package Reference: 603; Depth: 0.8mm; Mount: SurfaceMount; Package Description: 2-Pin Surface Mount Device, Body 1.6 x 0.85 mm; Datasheet Version: 02/2017; Length: 1.6mm; Lead Free: LeadFree; Height: 0.45mm; Number of Terminations: 2; Max Power Dissipation: 100mW; Min Operating Temperature: -55degC; Datasheet URL: https://industrial.panasonic.com/cdbs/www-data/pdf/RDA0000/AOA0000C304.pdf; Termination: SMD/SMT; Case Code (Metric): 1608; Case Code (Imperial): 0603; Tolerance: 1%; Max Operating Temperature: 155degC; RoHSCompliant: true; Voltage Rating (DC): 75V; Radiation Hardening: No; Packaging: TapeandReel; Composition: ThickFilm; Mounting Technology: SurfaceMount; Manufacturer URL: http://www.panasonic.com/; Width: 0.031inch; REACH SVHC: NoSVHC; Contact Plating: Tin; Military Standard: Not; Package Quantity: 1
R34-R38 = CMP-2000-00795-1: Part Number: ERJ-3GEYJ471V; Manufacturer: Panasonic; Value: 470
R43 = CMP-2000-00896-1: Part Number: ERA-3AEB121V; Manufacturer: Panasonic

## Sheet 10_IMU_BREAKOUT.SchDoc
size A
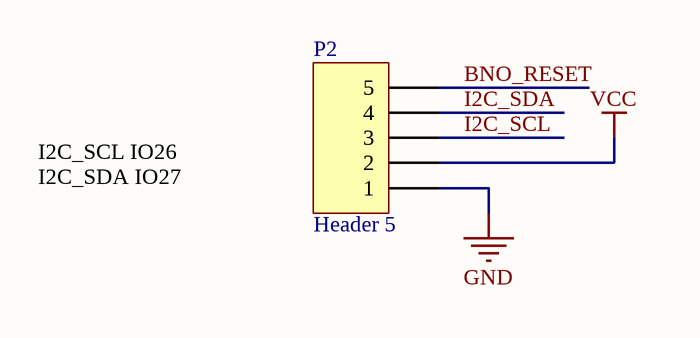
[diagram p4: 10_IMU_BREAKOUT.SchDoc]

### Parts
P2  Header 5  [HDR1X5]

### Nets
GND: P2.1
VCC: P2.2
BNO_RESET: P2.5
I2C_SCL: P2.3
I2C_SDA: P2.4

### Notes on the sheet
- I2C_SCL IO26
  I2C_SDA IO27

### Library data of the parts
P2 = Header 5: Header, 5-Pin; LatestRevisionDate: 17-Jul-2002; LatestRevisionNote: Re-released for DXP Platform.; Publisher: Altium Limited

## Sheet 11_GPS_BREAKOUT.SchDoc
size A
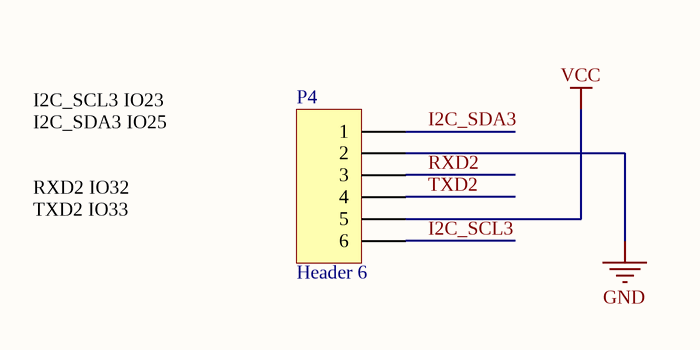
[diagram p5: 11_GPS_BREAKOUT.SchDoc]

### Parts
P4  Header 6  [HDR1X6]

### Nets
GND: P4.2
VCC: P4.5
I2C_SCL3: P4.6
I2C_SDA3: P4.1
RXD2: P4.3  [project net IO32]
TXD2: P4.4  [project net IO33]

### Notes on the sheet
- I2C_SCL3 IO23
  I2C_SDA3 IO25
- RXD2 IO32
  TXD2 IO33

### Library data of the parts
P4 = Header 6: Header, 6-Pin; LatestRevisionDate: 17-Jul-2002; LatestRevisionNote: Re-released for DXP Platform.; Publisher: Altium Limited

## Sheet 12_OLED_SCREEN.SchDoc
size A
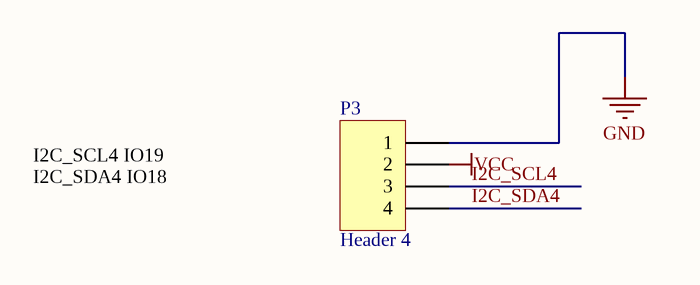
[diagram p6: 12_OLED_SCREEN.SchDoc]

### Parts
P3  Header 4  [HDR1X4]

### Nets
GND: P3.1
VCC: P3.2
I2C_SCL4: P3.3
I2C_SDA4: P3.4

### Notes on the sheet
- I2C_SCL4 IO19
  I2C_SDA4 IO18

### Library data of the parts
P3 = Header 4: Header, 4-Pin; LatestRevisionDate: 17-Jul-2002; LatestRevisionNote: Re-released for DXP Platform.; Publisher: Altium Limited

## Sheet 13_LED_Array.SchDoc
size A3
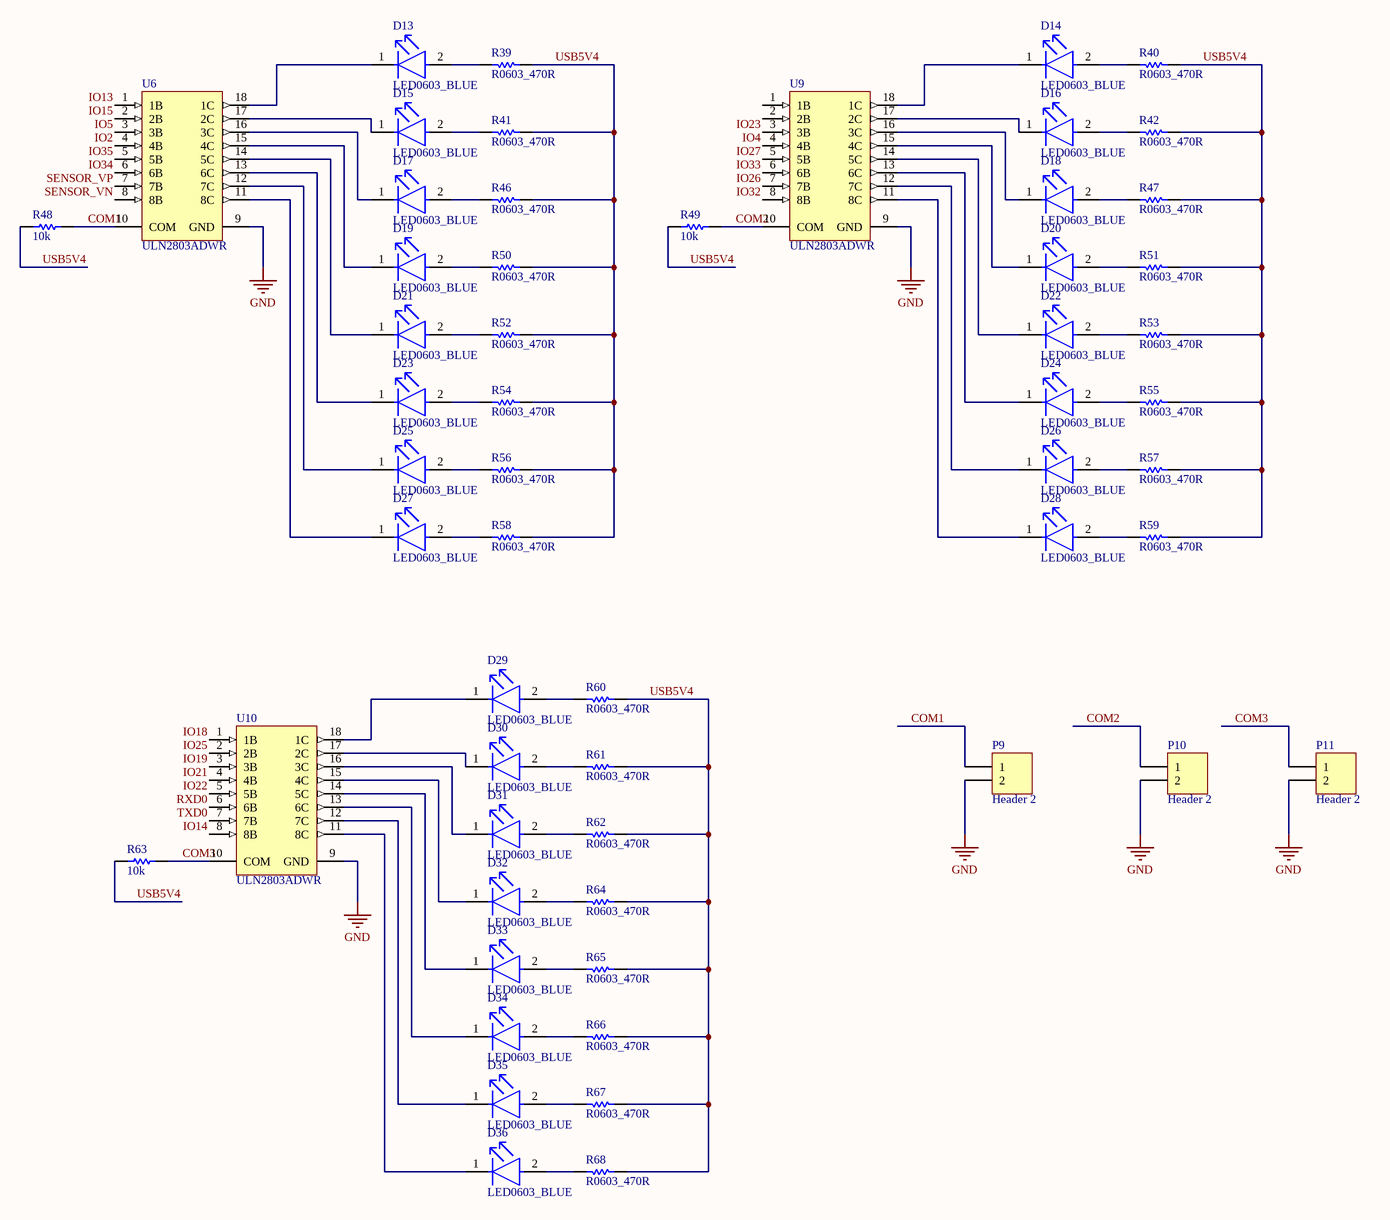
[diagram p7: 13_LED_Array.SchDoc]

### Parts
D13  LED0603_BLUE  [FP-LTST-C191TBKT-MFG]
D14  LED0603_BLUE  [FP-LTST-C191TBKT-MFG]
D15  LED0603_BLUE  [FP-LTST-C191TBKT-MFG]
D16  LED0603_BLUE  [FP-LTST-C191TBKT-MFG]
D17  LED0603_BLUE  [FP-LTST-C191TBKT-MFG]
D18  LED0603_BLUE  [FP-LTST-C191TBKT-MFG]
D19  LED0603_BLUE  [FP-LTST-C191TBKT-MFG]
D20  LED0603_BLUE  [FP-LTST-C191TBKT-MFG]
D21  LED0603_BLUE  [FP-LTST-C191TBKT-MFG]
D22  LED0603_BLUE  [FP-LTST-C191TBKT-MFG]
D23  LED0603_BLUE  [FP-LTST-C191TBKT-MFG]
D24  LED0603_BLUE  [FP-LTST-C191TBKT-MFG]
D25  LED0603_BLUE  [FP-LTST-C191TBKT-MFG]
D26  LED0603_BLUE  [FP-LTST-C191TBKT-MFG]
D27  LED0603_BLUE  [FP-LTST-C191TBKT-MFG]
D28  LED0603_BLUE  [FP-LTST-C191TBKT-MFG]
D29  LED0603_BLUE  [FP-LTST-C191TBKT-MFG]
D30  LED0603_BLUE  [FP-LTST-C191TBKT-MFG]
D31  LED0603_BLUE  [FP-LTST-C191TBKT-MFG]
D32  LED0603_BLUE  [FP-LTST-C191TBKT-MFG]
D33  LED0603_BLUE  [FP-LTST-C191TBKT-MFG]
D34  LED0603_BLUE  [FP-LTST-C191TBKT-MFG]
D35  LED0603_BLUE  [FP-LTST-C191TBKT-MFG]
D36  LED0603_BLUE  [FP-LTST-C191TBKT-MFG]
P9  Header 2  [HDR1X2]
P10  Header 2  [HDR1X2]
P11  Header 2  [HDR1X2]
R39  R0603_470R  [RESC1608X55X30NL15T15]
R40  R0603_470R  [RESC1608X55X30NL15T15]
R41  R0603_470R  [RESC1608X55X30NL15T15]
R42  R0603_470R  [RESC1608X55X30NL15T15]
R46  R0603_470R  [RESC1608X55X30NL15T15]
R47  R0603_470R  [RESC1608X55X30NL15T15]
R48  value 10k  [RESC1609X55X30LL15T15]  (hidden comment: R0603_10K)
R49  value 10k  [RESC1609X55X30LL15T15]  (hidden comment: R0603_10K)
R50  R0603_470R  [RESC1608X55X30NL15T15]
R51  R0603_470R  [RESC1608X55X30NL15T15]
R52  R0603_470R  [RESC1608X55X30NL15T15]
R53  R0603_470R  [RESC1608X55X30NL15T15]
R54  R0603_470R  [RESC1608X55X30NL15T15]
R55  R0603_470R  [RESC1608X55X30NL15T15]
R56  R0603_470R  [RESC1608X55X30NL15T15]
R57  R0603_470R  [RESC1608X55X30NL15T15]
R58  R0603_470R  [RESC1608X55X30NL15T15]
R59  R0603_470R  [RESC1608X55X30NL15T15]
R60  R0603_470R  [RESC1608X55X30NL15T15]
R61  R0603_470R  [RESC1608X55X30NL15T15]
R62  R0603_470R  [RESC1608X55X30NL15T15]
R63  value 10k  [RESC1609X55X30LL15T15]  (hidden comment: R0603_10K)
R64  R0603_470R  [RESC1608X55X30NL15T15]
R65  R0603_470R  [RESC1608X55X30NL15T15]
R66  R0603_470R  [RESC1608X55X30NL15T15]
R67  R0603_470R  [RESC1608X55X30NL15T15]
R68  R0603_470R  [RESC1608X55X30NL15T15]
U6  ULN2803ADWR  [DW0018A_L]
U9  ULN2803ADWR  [DW0018A_L]
U10  ULN2803ADWR  [DW0018A_L]

### Nets
GND: P9.2 P10.2 P11.2 U6.9(GND) U9.9(GND) U10.9(GND)
COM1: P9.1 R48.2 U6.10(COM)
COM2: P10.1 R49.2 U9.10(COM)
COM3: P11.1 R63.2 U10.10(COM)
IO2: U6.4(4B)
IO4: U9.4(4B)  [project net BNO_RESET]
IO5: U6.3(3B)
IO13: U6.1(1B)
IO14: U10.8(8B)
IO15: U6.2(2B)
IO18: U10.1(1B)  [project net I2C_SDA4]
IO19: U10.3(3B)  [project net I2C_SCL4]
IO21: U10.4(4B)  [project net I2C_SCL2]
IO22: U10.5(5B)  [project net I2C_SDA2]
IO23: U9.3(3B)  [project net I2C_SCL3]
IO25: U10.2(2B)  [project net I2C_SDA3]
IO26: U9.7(7B)  [project net I2C_SCL]
IO27: U9.5(5B)  [project net I2C_SDA]
IO32: U9.8(8B)
IO33: U9.6(6B)
IO34: U6.6(6B)
IO35: U6.5(5B)
RXD0: U10.6(6B)
SENSOR_VN: U6.8(8B)
SENSOR_VP: U6.7(7B)
TXD0: U10.7(7B)
USB5V4: R39.1 R40.1 R41.1 R42.1 R46.1 R47.1 R48.1 R49.1 R50.1 R51.1 R52.1 R53.1 R54.1 R55.1 R56.1 R57.1 R58.1 R59.1 R60.1 R61.1 R62.1 R63.1 R64.1 R65.1 R66.1 R67.1 R68.1
NetD13_1: D13.1(C) U6.18(1C)
NetD13_2: D13.2(A) R39.2
NetD14_1: D14.1(C) U9.18(1C)
NetD14_2: D14.2(A) R40.2
NetD15_1: D15.1(C) U6.17(2C)
NetD15_2: D15.2(A) R41.2
NetD16_1: D16.1(C) U9.17(2C)
NetD16_2: D16.2(A) R42.2
NetD17_1: D17.1(C) U6.16(3C)
NetD17_2: D17.2(A) R46.2
NetD18_1: D18.1(C) U9.16(3C)
NetD18_2: D18.2(A) R47.2
NetD19_1: D19.1(C) U6.15(4C)
NetD19_2: D19.2(A) R50.2
NetD20_1: D20.1(C) U9.15(4C)
NetD20_2: D20.2(A) R51.2
NetD21_1: D21.1(C) U6.14(5C)
NetD21_2: D21.2(A) R52.2
NetD22_1: D22.1(C) U9.14(5C)
NetD22_2: D22.2(A) R53.2
NetD23_1: D23.1(C) U6.13(6C)
NetD23_2: D23.2(A) R54.2
NetD24_1: D24.1(C) U9.13(6C)
NetD24_2: D24.2(A) R55.2
NetD25_1: D25.1(C) U6.12(7C)
NetD25_2: D25.2(A) R56.2
NetD26_1: D26.1(C) U9.12(7C)
NetD26_2: D26.2(A) R57.2
NetD27_1: D27.1(C) U6.11(8C)
NetD27_2: D27.2(A) R58.2
NetD28_1: D28.1(C) U9.11(8C)
NetD28_2: D28.2(A) R59.2
NetD29_1: D29.1(C) U10.18(1C)
NetD29_2: D29.2(A) R60.2
NetD30_1: D30.1(C) U10.17(2C)
NetD30_2: D30.2(A) R61.2
NetD31_1: D31.1(C) U10.16(3C)
NetD31_2: D31.2(A) R62.2
NetD32_1: D32.1(C) U10.15(4C)
NetD32_2: D32.2(A) R64.2
NetD33_1: D33.1(C) U10.14(5C)
NetD33_2: D33.2(A) R65.2
NetD34_1: D34.1(C) U10.13(6C)
NetD34_2: D34.2(A) R66.2
NetD35_1: D35.1(C) U10.12(7C)
NetD35_2: D35.2(A) R67.2
NetD36_1: D36.1(C) U10.11(8C)
NetD36_2: D36.2(A) R68.2

Not connected (* = marked no-connect by the designer): U9 1(1B) 2(2B)

### Notes on the sheet
- Title
- Size:
- Date:
- A3
- Number:
- Time:
- Revision:
- Sheet
- of
- File:

### Library data of the parts
D13-D36 = CMP-22017-000008-1: as D4 on sheet 08_CoreBoard; Case Code (Metric): 1608; Packaging: Tape and Reel; Case/Package: 0603; Depth: 1.6mm; Mount: Surface Mount; Lead Free: Lead Free; Min Operating Temperature: -20°C; Lens Transparency: Clear; Illumination Color: Blue; Height: 0.55mm; Test Current: 20mA; Case Code (Imperial): 0603; Max Operating Temperature: 80°C; Number of Pins: 2; Length: 0.8mm; Radiation Hardening: No; Package Quantity: 1; Number of LEDs: 1; Width: 0.8mm; Color: Blue
P9-P11 = Header 2: Header, 2-Pin; LatestRevisionDate: 17-Jul-2002; LatestRevisionNote: Re-released for DXP Platform.; Publisher: Altium Limited
R39-R42 R46 R47 R50-R62 R64-R68 = CMP-2000-00795-1: as R34 on sheet 08_CoreBoard
R48 R49 R63 = CMP-2000-07452-1: as R45 on sheet 02_USB2UART; Number of Pins: 2; Package Reference: 603; Depth: 0.8mm; Mount: SurfaceMount; Package Description: 2-Pin Surface Mount Device, Body 1.6 x 0.85 mm; Datasheet Version: 02/2017; Length: 1.6mm; Lead Free: LeadFree; Height: 0.45mm; Number of Terminations: 2; Max Power Dissipation: 100mW; Min Operating Temperature: -55degC; Datasheet URL: https://industrial.panasonic.com/cdbs/www-data/pdf/RDA0000/AOA0000C304.pdf; Termination: SMD/SMT; Case Code (Metric): 1608; Case Code (Imperial): 0603; Tolerance: 1%; Max Operating Temperature: 155degC; RoHSCompliant: true; Voltage Rating (DC): 75V; Radiation Hardening: No; Packaging: TapeandReel; Composition: ThickFilm; Mounting Technology: SurfaceMount; Manufacturer URL: http://www.panasonic.com/; Width: 0.031inch; REACH SVHC: NoSVHC; Contact Plating: Tin; Military Standard: Not; Package Quantity: 1
U6 U9 U10 = CMP-2000-07354-1: Darlington Transistor Array, -40 to 85 degC, 18-Pin SOIC (DW), Green (RoHS & no Sb/Br), Tape and Reel; Manufacturer: Texas Instruments; Package Version: 4040000-3/G, 01/2011; Other Names: 296-15777-6; Voltage - Supply: 5V; IR Max: 50uA; Number of Drivers/Receivers: 8/0; VF: 1.7V; Dynamic Catalog: DarlingtonArrays; Package Description: 18-Pin Plastic Small Outline, Body 11.55 x 7.5 mm, Pitch 1.27 mm; Mounting Technology: SurfaceMount; Packaging: Digi-Reel®; Protocol: -; Family: Interface-Drivers,Receivers,Transceivers; Package Reference: DW18; Mounting Type: SurfaceMount; Type: DarlingtonArray; Category: IntegratedCircuits(ICs); Series: -; PartNumber: ULN2803A; Manufacturer URL: http://www.ti.com/; Package / Case: 18-SOIC(0.295",7.50mmWidth); Standard Package: 1; Datasheet Version: Rev. G, 01/2015; Supplier Device Package: 18-SOIC; Package URL: http://www.ti.com/lit/ml/mpds172a/mpds172a.pdf; Datasheet URL: http://www.ti.com/lit/ds/symlink/uln2803a.pdf

## Nets that join several sheets
GND: 01_powersupply (15 pins), 02_USB2UART (20 pins), 05_PWMdriver (25 pins), 08_CoreBoard (16 pins), 10_IMU_BREAKOUT (P2.1), 11_GPS_BREAKOUT (P4.2), 12_OLED_SCREEN (P3.1), 13_LED_Array (6 pins)
PWM_VDD: 01_powersupply (9 pins), 02_USB2UART (D1.2), 05_PWMdriver (18 pins)
VCC: 02_USB2UART (7 pins), 05_PWMdriver (R22.2 R23.2), 08_CoreBoard (9 pins), 10_IMU_BREAKOUT (P2.2), 11_GPS_BREAKOUT (P4.5), 12_OLED_SCREEN (P3.2)
BNO_RESET: 08_CoreBoard (MD1.26), 10_IMU_BREAKOUT (P2.5), 13_LED_Array (U9.4)
I2C_SCL: 08_CoreBoard (MD1.11), 10_IMU_BREAKOUT (P2.3), 13_LED_Array (U9.7)
I2C_SCL2: 05_PWMdriver (R23.1 U7.26), 08_CoreBoard (MD1.33), 13_LED_Array (U10.4)
I2C_SCL3: 08_CoreBoard (MD1.37), 11_GPS_BREAKOUT (P4.6), 13_LED_Array (U9.3)
I2C_SCL4: 08_CoreBoard (MD1.31), 12_OLED_SCREEN (P3.3), 13_LED_Array (U10.3)
I2C_SDA: 08_CoreBoard (MD1.12), 10_IMU_BREAKOUT (P2.4), 13_LED_Array (U9.5)
I2C_SDA2: 05_PWMdriver (R22.1 U7.27), 08_CoreBoard (MD1.36), 13_LED_Array (U10.5)
I2C_SDA3: 08_CoreBoard (MD1.10), 11_GPS_BREAKOUT (P4.1), 13_LED_Array (U10.2)
I2C_SDA4: 08_CoreBoard (MD1.30), 12_OLED_SCREEN (P3.4), 13_LED_Array (U10.1)
IO2: 08_CoreBoard (MD1.24 P8.6 R34.1), 13_LED_Array (U6.4)
IO5: 08_CoreBoard (MD1.29 P8.5 R35.1), 13_LED_Array (U6.3)
IO13: 08_CoreBoard (MD1.16 P8.2 R36.1), 13_LED_Array (U6.1)
IO14: 08_CoreBoard (MD1.13 P8.1 R37.1), 13_LED_Array (U10.8)
IO15: 08_CoreBoard (MD1.23 P8.4 R38.1), 13_LED_Array (U6.2)
IO32: 08_CoreBoard (MD1.8), 11_GPS_BREAKOUT (P4.3), 13_LED_Array (U9.8)
IO33: 08_CoreBoard (MD1.9), 11_GPS_BREAKOUT (P4.4), 13_LED_Array (U9.6)
IO34: 08_CoreBoard (MD1.6 P8.8), 13_LED_Array (U6.6)
IO35: 08_CoreBoard (MD1.7 P8.7), 13_LED_Array (U6.5)
RXD0: 02_USB2UART (P1.2 U5.21), 08_CoreBoard (MD1.34), 13_LED_Array (U10.6)
SENSOR_VN: 08_CoreBoard (MD1.5 P8.10), 13_LED_Array (U6.8)
SENSOR_VP: 08_CoreBoard (MD1.4 P8.9), 13_LED_Array (U6.7)
TXD0: 02_USB2UART (P1.3 U5.20), 08_CoreBoard (MD1.35), 13_LED_Array (U10.7)
USB5V4: 02_USB2UART (D2.2 D3.2 J1.1 P1.1), 05_PWMdriver (D5.2 D7.2), 13_LED_Array (27 pins)